# EAGLE design LM317 PSU (EAGLE 6.2)
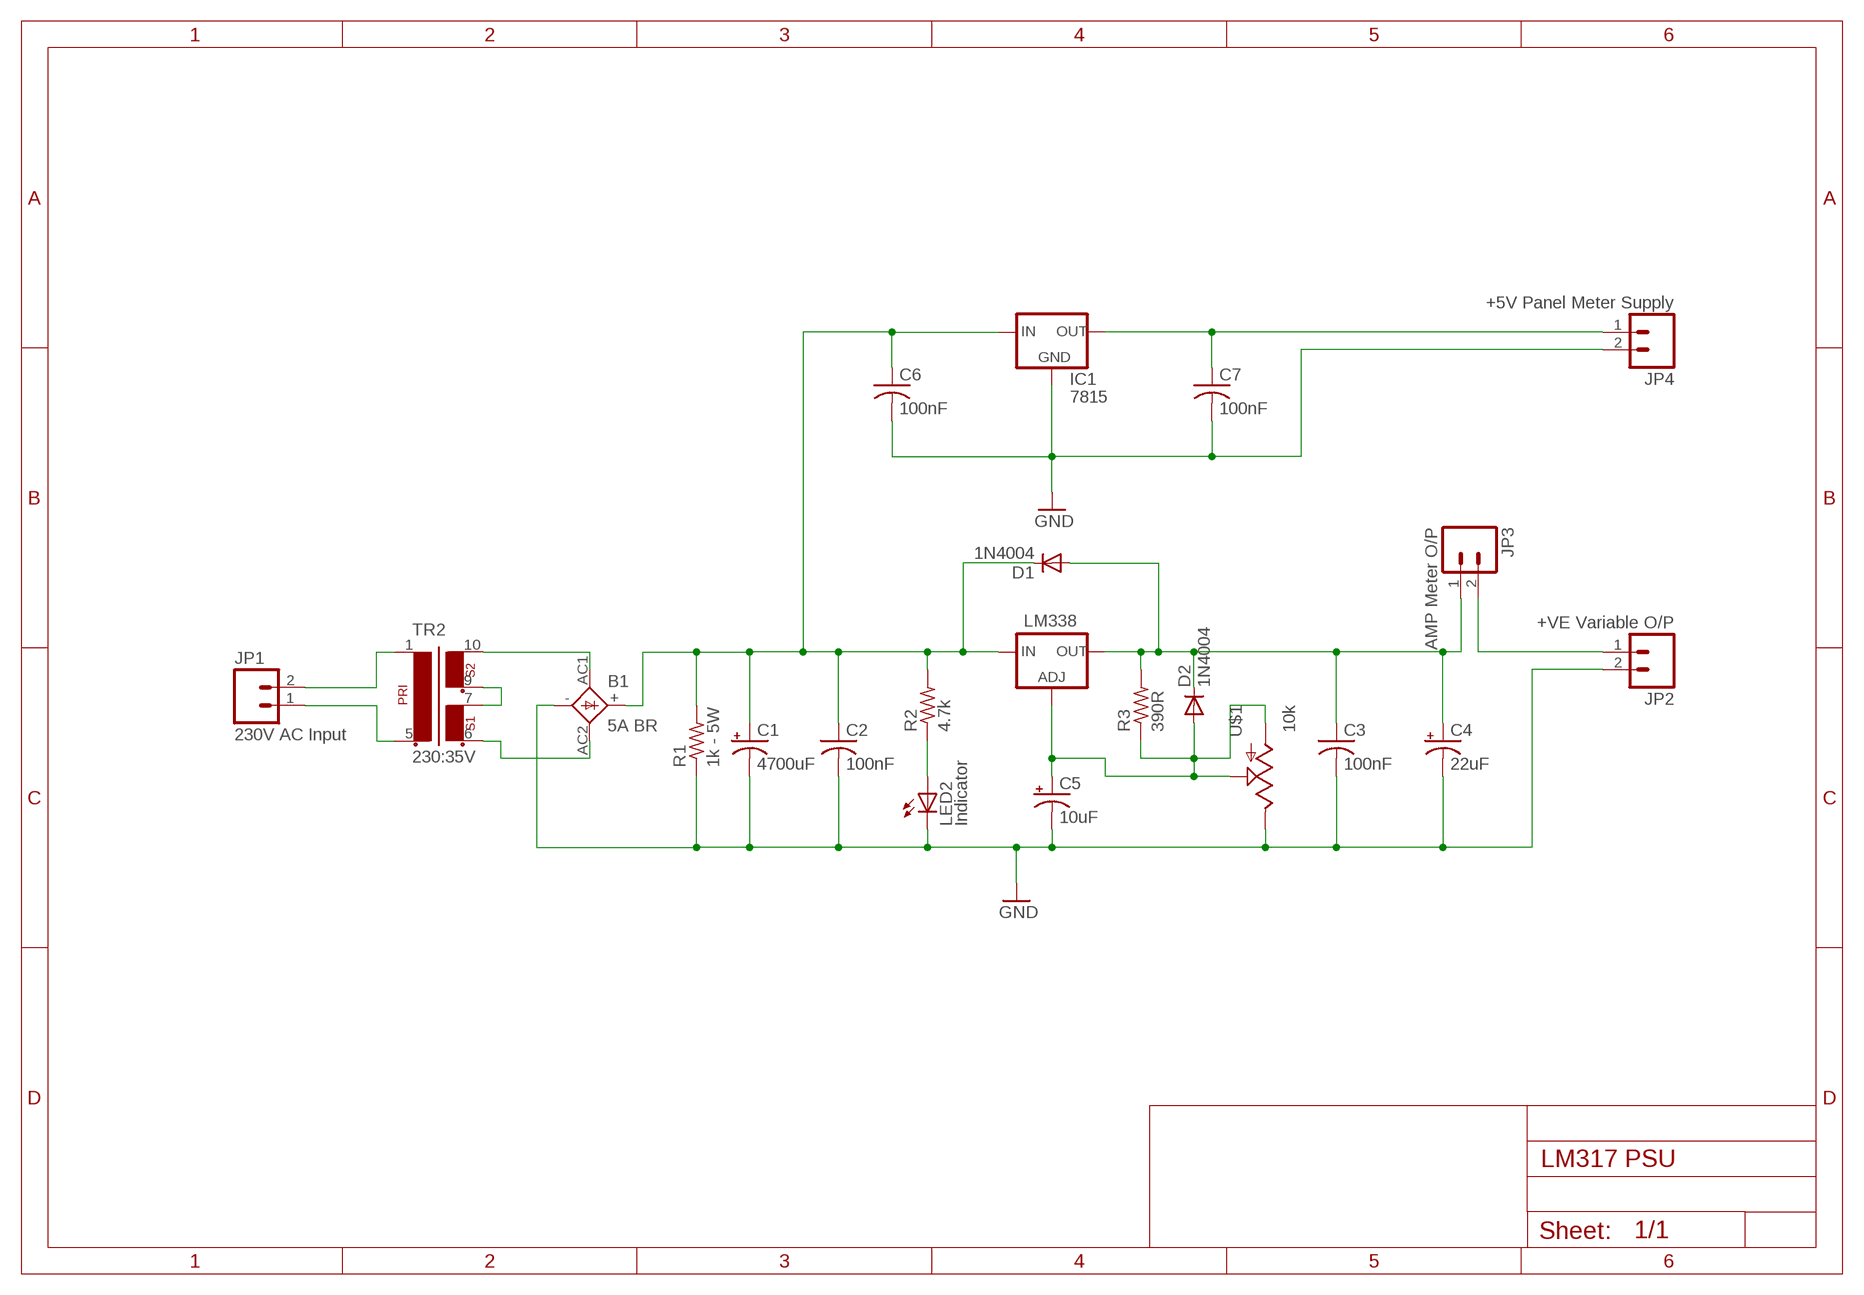
[diagram p0: schematic, sheet 1]

## Parts
B1  5A BR  GBPC80X  [GBPC80X]
C1  4700uF  CPOL-USE7.5-16  [E7,5-16]
C2  100nF  C-US025-040X050  [C025-040X050]
C3  100nF  C-US025-040X050  [C025-040X050]
C4  22uF  CPOL-USE5-6  [E5-6]
C5  10uF  CPOL-USE5-6  [E5-6]
C6  100nF  C-US025-040X050  [C025-040X050]
C7  100nF  C-US025-040X050  [C025-040X050]
D1  1N4004  [DO41-10]
D2  1N4004  [DO41-10]
IC1  7815  V_REG_78XXSINK  [TO220-IGO]
JP1  230V AC Input  M025MM  [SCREWTERMINAL-5MM-2]
JP2  +VE Variable O/P  M025MM  [SCREWTERMINAL-5MM-2]
JP3  AMP Meter O/P  M025MM  [SCREWTERMINAL-5MM-2]
JP4  +5V Panel Meter Supply  M025MM  [SCREWTERMINAL-5MM-2]
LED2  Indicator  LED5MM  [LED5MM]
LM338  V_REG_317SINK  [TO220-ADJ]
R1  1k - 5W  R-US_V234/12  [V234/12]
R2  4.7k  R-US_FLIPFLOP  [0805-THM]
R3  390R  R-US_FLIPFLOP  [0805-THM]
TR2  230:35V  EI42-2  [EI42-2]
U$1  10k  POT-RV16AF-20  [POT_ALPHA_RV16AF-20]

## Nets
GND: B1.- C1.- C2.2 C3.2 C4.- C5.- C6.2 C7.2 IC1.GND JP2.2 JP4.2 LED2.K(C) R1.1 U$1.3(E)
N$1: JP1.2 TR2.1
N$2: JP1.1 TR2.5
N$3: B1.AC1 TR2.10
N$4: B1.AC2 TR2.6
N$5: TR2.7 TR2.9
N$6: B1.+ C1.+ C2.1 C6.1 D1.C IC1.IN LM338.IN R1.2 R2.2
N$7: LED2.A R2.1
N$8: C5.+ D2.A LM338.ADJ R3.1 U$1.1(A) U$1.2(S)
N$10: C7.1 IC1.OUT JP4.1
N$11: C3.1 C4.+ D1.A D2.C JP3.1 LM338.OUT R3.2
N$15: JP2.1 JP3.2

## Library data of the parts
B1 = rectifier:GBPC80X: GENERAL INSTRUMENT RECTIFIER
C1 C4 C5 = adafruit:CPOL-US: POLARIZED CAPACITOR, American symbol
C2 C3 C6 C7 = adafruit:C-US: CAPACITOR, American symbol
D1 D2 = diode:1N4004: DIODE general purpose rectifier, 1 A
IC1 = SparkFun:V_REG_78XX: Voltage Regulator Standard 7805 5V regulator. IGO (Input Ground Output). Spark Fun Electronics SKU : COM-00107
JP1-JP4 = SparkFun:M02: Header 2 Standard 2-pin 0.1" header. Use with straight break away headers (SKU : PRT-00116), right angle break away headers (PRT-00553), swiss pins (PRT-00743), machine pins (PRT-00117), and female headers (PRT-00115). Molex polarized connector foot print use with SKU : PRT-08233 with associated crimp pins and housings.
LED2 = adafruit:LED: LED OSRAM: - CHIPLED LG R971, LG N971, LY N971, LG Q971, LY Q971, LO R971, LY R971 LH N974, LH R974 LS Q976, LO Q976, LY Q976 LO Q996 - Hyper CHIPLED LW Q18S LB Q993, LB Q99A, LB R99A - SideLED LS A670, LO A670, LY A670, LG A670, LP A670 LB A673, LV A673, LT A673, LW A673 LH A674 LY A675 LS A676, LA A676, LO A676, LY A676, LW A676 LS A679, LY A679, LG A679 - Hyper Micro SIDELED® LS Y876, LA Y876, LO Y876, LY Y876 LT Y87S - SmartLED LW L88C, LW L88S LB L89C, LB L89S, LG L890 LS L89K, LO L89K, LY L89K LS L896, LA L896, LO L896, LY L896 - TOPLED LS T670, LO T670, LY T670, LG T670, LP T670 LSG T670, LSP T670, LSY T670, LOP T670, LYG T670 LG T671, LOG T671, LSG T671 LB T673, LV T673, LT T673, LW T673 LH T674 LS T676, LA T676, LO T676, LY T676, LB T676, LH T676, LSB T676, LW T676 LB T67C, LV T67C, LT T67C, LS T67K, LO T67K, LY T67K, LW E67C LS E67B, LA E67B, LO E67B, LY E67B, LB E67C, LV E67C, LT E67C LW T67C LS T679, LY T679, LG T679 LS T770, LO T770, LY T770, LG T770, LP T770 LB T773, LV T773, LT T773, LW T773 LH T774 LS E675, LA E675, LY E675, LS T675 LS T776, LA T776, LO T776, LY T776, LB T776 LHGB T686 LT T68C, LB T68C - Hyper Mini TOPLED® LB M676 - Mini TOPLED Santana® LG M470 LS M47K, LO M47K, LY M47K Source: http://www.osram.convergy.de/
LM338 = SparkFun:V_REG_317: Voltage Regulator Standard LM317 adjustable voltage regulator. AOI (Adjust Output Input). Google 'LM317 Calculator' for easy to use app to get the two resistor values needed. 240/720 for 5V output. 240/390 for 3.3V output. Spark Fun Electronics SKU : COM-00527
R1-R3 = adafruit:R-US_: RESISTOR, American symbol
TR2 = trafo:EI42-2: TRANSFORMER 1 primary winding, 2 secondary windings ERA
U$1 = SparkFun:POT

## Board
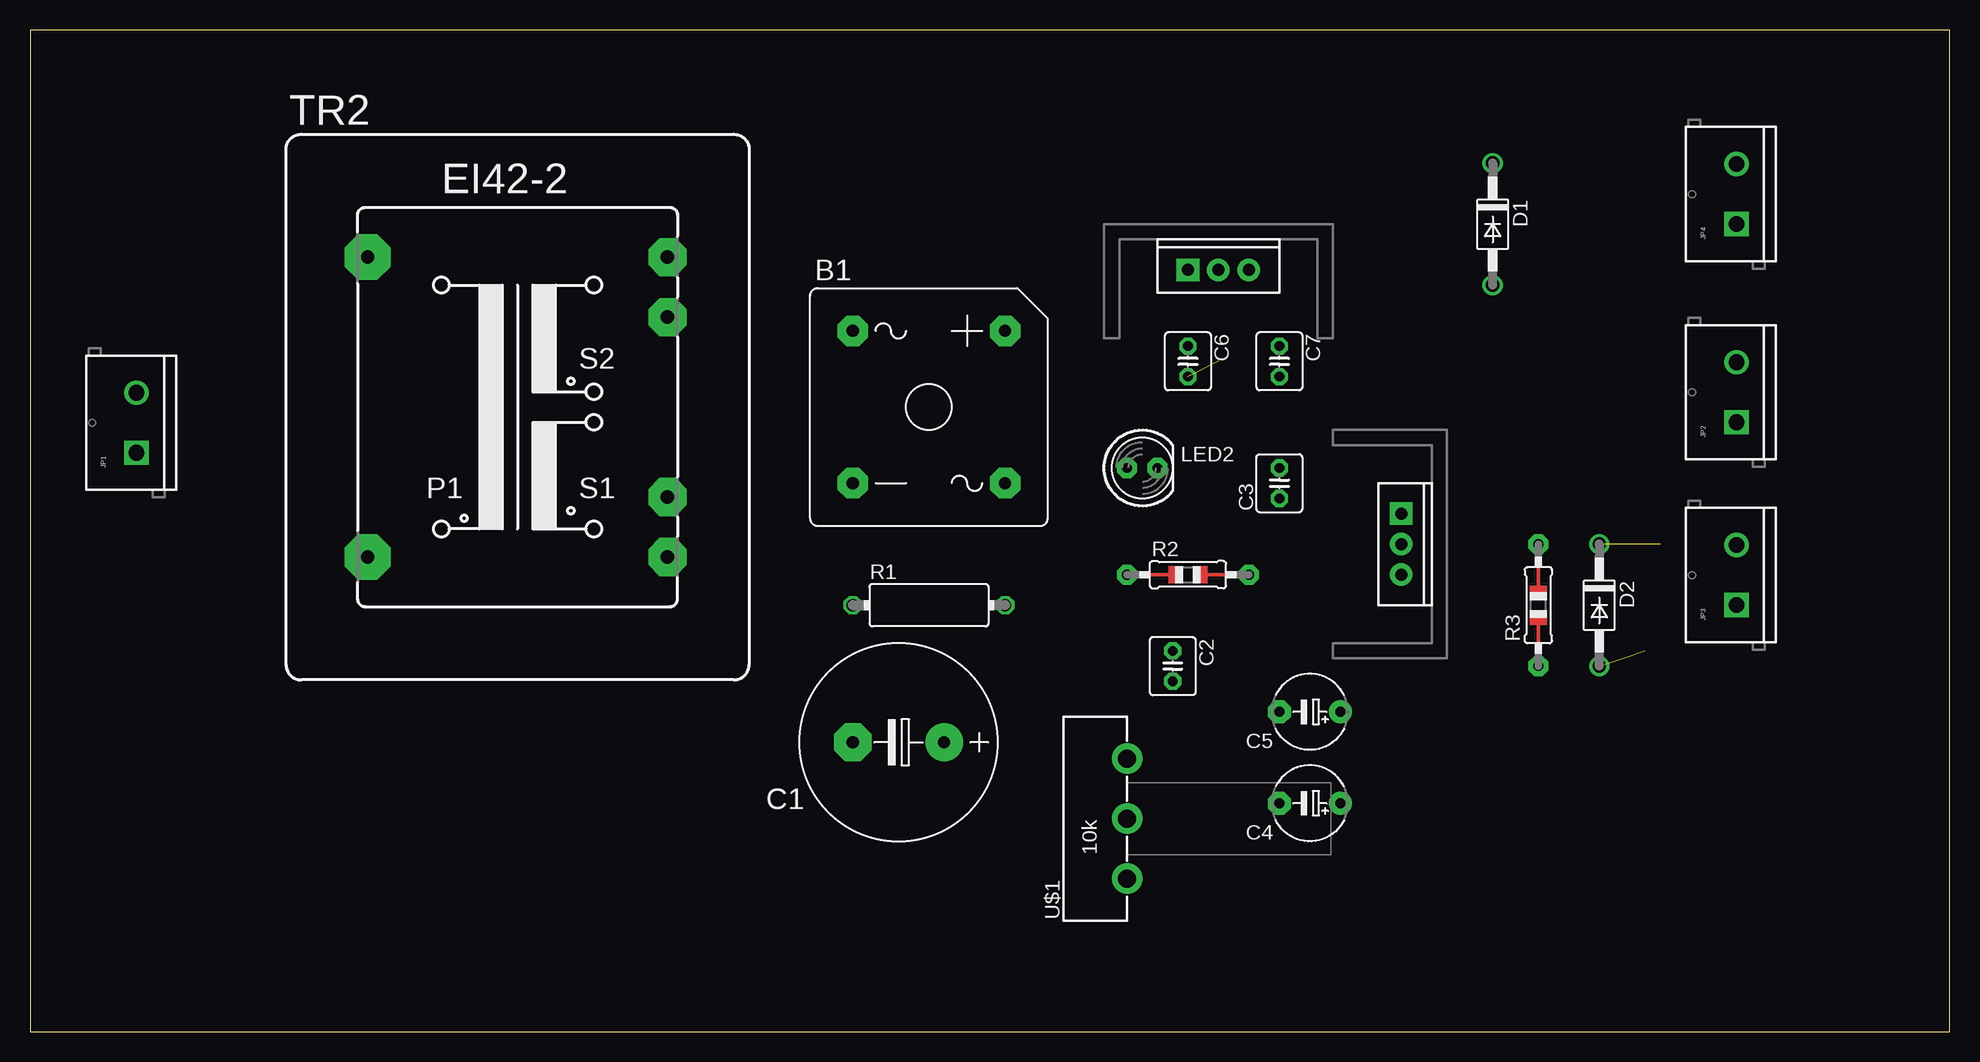
[diagram p1: board, top side]
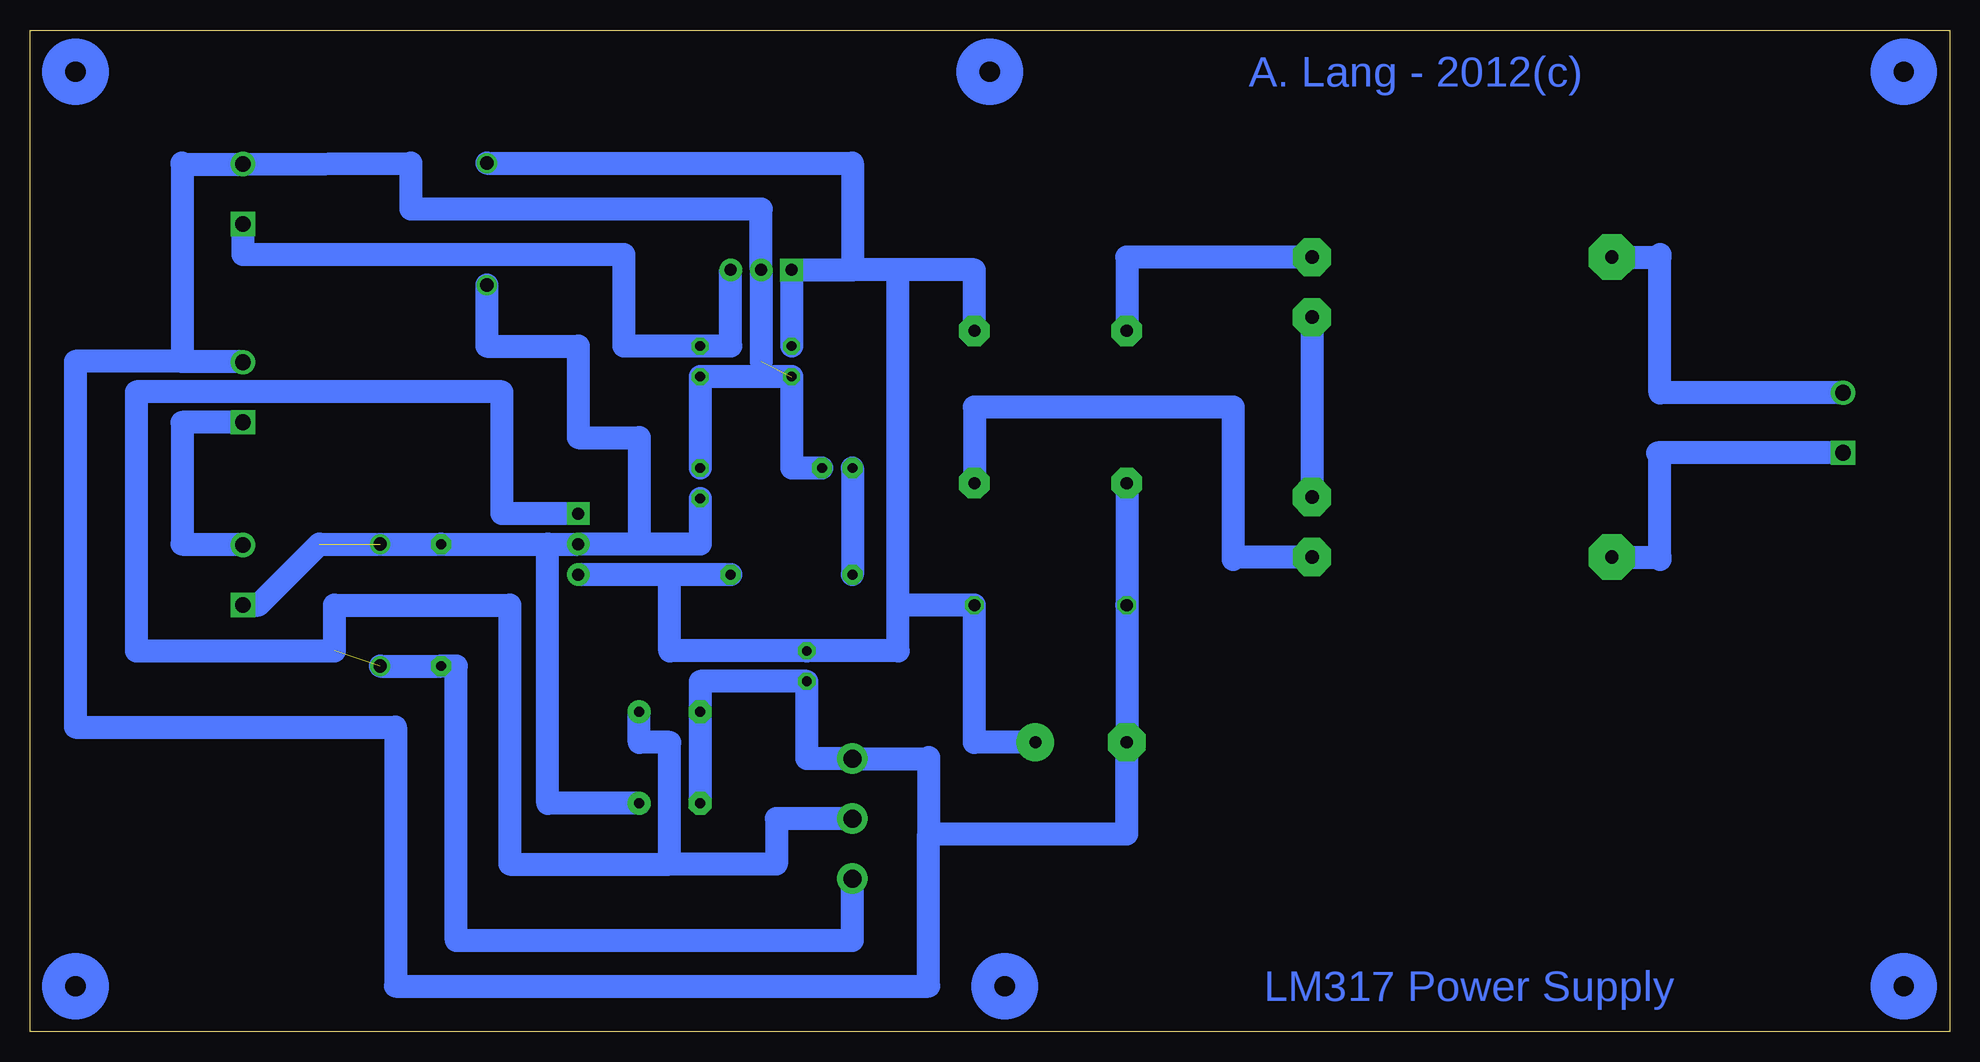
[diagram p2: board, bottom side, seen from below]

Size 160 x 83.49 mm. Coordinates in mm from the lower left corner, seen from the top.
Outline: 0,0 160,0 160,83.49 0,83.49 0,0
Copper layers (1*16): Top 0.035mm / dielectric 1.5mm / Bottom 0.035mm
Design rules: minimum track width 10mil, minimum drill 24mil, track to track 8mil, track to pad 8mil, pad to pad 8mil, via to via 8mil, smd to smd 8mil, copper to edge 40mil, drill to drill 8mil, minimum pad ring 10mil, minimum via ring 8mil, stop-mask expansion 4mil, vias tented up to drill 0mil, thermal gap 10mil

### Footprints (pad centres in the part's own frame; a part is rotated, then mirrored left to right if it is on the bottom)
GBPC80X = drill 1.016 pad 2.54 octagon: + 6.35,6.35; - -6.35,-6.35; AC1 -6.35,6.35; AC2 6.35,-6.35
E7,5-16 = drill 1.016 pad 3.15: + -3.81,0 | drill 1.016 pad 3.15 octagon: - 3.81,0
C025-040X050 = drill 0.813 pad 1.422 octagon: 1 -1.27,0; 2 1.27,0
E5-6 = drill 0.813 pad 1.905: + -2.54,0 | drill 0.813 pad 1.905 octagon: - 2.54,0
DO41-10 = drill 1.118: A 5.08,0; C -5.08,0
TO220-IGO = drill 1 pad 1.88: GND 0,0; OUT 2.54,0 | drill 1 pad 1.88 square: IN -2.54,0
SCREWTERMINAL-5MM-2 = drill 1.3 pad 2.032 square: 1 0,0 | drill 1.3 pad 2.032: 2 5,0
LED5MM = drill 0.813 pad 1.676 octagon: A -1.27,0; K 1.27,0
TO220-ADJ = drill 1 pad 1.88 square: ADJ -2.54,0 | drill 1 pad 1.88: IN 2.54,0; OUT 0,0
V234/12 = drill 1.016 octagon: 1 -6.35,0; 2 6.35,0
0805-THM = drill 0.813 pad 1.676 octagon: 1 -5.08,0; 2 5.08,0
EI42-2 = drill 1.118 pad 3.81 octagon: 1 -12.497,12.497; 5 -12.497,-12.497 | drill 1.118 pad 3.175 octagon: 6 12.497,-12.497; 7 12.497,-7.493; 9 12.497,7.493; 10 12.497,12.497
POT_ALPHA_RV16AF-20 = drill 1.5 pad 2.54: 1 -5,0; 2 0,0; 3 5,0

### Placement (x,y rotation side)
B1  74.93,52.07 0 top
C1  72.39,24.13 180 top
C2  95.25,30.48 270 top
C3  104.14,45.72 90 top
C4  106.68,19.05 180 top
C5  106.68,26.67 180 top
C6  96.52,55.88 270 top
C7  104.14,55.88 270 top
D1  121.92,67.31 270 top
D2  130.81,35.56 270 top
IC1  99.06,63.5 0 top
JP1  8.89,48.26 90 top
JP2  142.24,50.8 90 top
JP3  142.24,35.56 90 top
JP4  142.24,67.31 90 top
LED2  92.71,46.99 0 top
LM338  114.3,40.64 270 top
R1  74.93,35.56 0 top
R2  96.52,38.1 0 top
R3  125.73,35.56 90 top
TR2  40.64,52.07 0 top
U$1  91.44,17.78 90 top

### Tracks (layer width: path | path; a pad name or v marks a point on that pad's centre or on a via)
GND  (1 unrouted)
  Bottom 1.93: LED2.K 96.52,46.99 C6.2 C7.2 C3.2 | C4.- C5.- 104.14,29.21 C2.2 95.25,22.78 U$1.3 85.09,22.78 | 85.09,22.78 85.09,22.86 | 85.09,22.78 85.09,16.51 | 85.09,16.51 68.58,16.51 C1.- R1.1 B1.- | 147.32,72.39 147.32,72.31 | 147.32,72.31 147.32,55.88 | 147.32,55.88 142.24,55.88 JP2.2 | 147.32,55.88 156.21,55.88 156.21,25.4 129.54,25.4 129.54,3.81 85.09,3.81 85.09,16.51 | 147.32,72.31 JP4.2 128.27,72.39 128.27,68.58 99.06,68.58 IC1.GND 99.06,55.88
N$1
  Bottom 1.93: JP1.2 24.13,53.26 24.13,64.57 | TR2.1 24.13,64.57 | 24.13,64.57 24.13,64.77
N$2
  Bottom 1.93: JP1.1 24.13,48.26 | 24.13,48.26 24.33,48.26 | TR2.5 24.13,39.57 | 24.13,39.57 24.13,39.37 | 24.13,39.57 24.13,48.26
N$3
  Bottom 1.93: TR2.10 68.58,64.57 B1.AC1
N$4
  Bottom 1.93: TR2.6 59.69,39.57 | 59.69,39.57 59.69,39.37 | 59.69,39.57 59.69,52.07 81.28,52.07 B1.AC2
N$5
  Bottom 1.93: TR2.9 TR2.7
N$6
  Bottom 1.93: B1.+ 81.28,63.5 87.63,63.5 | 87.63,63.5 91.44,63.5 | R2.2 106.68,38.1 | 106.68,38.1 LM338.IN | 87.63,35.56 87.63,31.75 C2.1 106.68,31.75 106.68,38.1 | 87.63,35.56 87.63,63.5 | D1.C 91.44,72.39 91.44,63.5 | 91.44,63.5 IC1.IN C6.1 | C1.+ 81.28,24.13 R1.2 87.63,35.56
N$7
  Bottom 1.93: LED2.A R2.1
N$8  (1 unrouted)
  Bottom 1.93: D2.A R3.1 124.46,30.48 124.46,7.62 91.44,7.62 U$1.1 | U$1.2 97.79,17.78 97.79,13.97 106.68,13.97 | 106.68,13.97 106.68,24.13 109.22,24.13 C5.+ | LM338.ADJ 120.65,43.18 120.65,53.34 151.13,53.34 151.13,31.75 134.62,31.75 134.62,35.56 120.02,35.56 120.02,13.97 106.68,13.97
N$10
  Bottom 1.93: JP4.1 142.24,64.77 110.49,64.77 110.49,57.15 C7.1 101.6,57.15 IC1.OUT
N$11  (1 unrouted)
  Bottom 1.93: C3.1 104.14,40.64 109.22,40.64 | 109.22,40.64 LM338.OUT 116.84,40.64 | JP3.1 140.97,35.56 135.89,40.64 R3.2 116.84,40.64 | D1.A 121.92,57.15 114.3,57.15 114.3,49.53 109.22,49.53 109.22,40.64 | C4.+ 116.84,19.05 116.84,40.64
N$15
  Bottom 1.93: JP2.1 147.32,50.8 147.32,40.64 142.24,40.64 JP3.2
(copper drawn outside any net)
  shapes: Bottom circle x6

### Text on the board
Bottom: A. Lang - 2012(c) | LM317 Power Supply